# Altium schematic sheet catalog.SchDoc
size A4
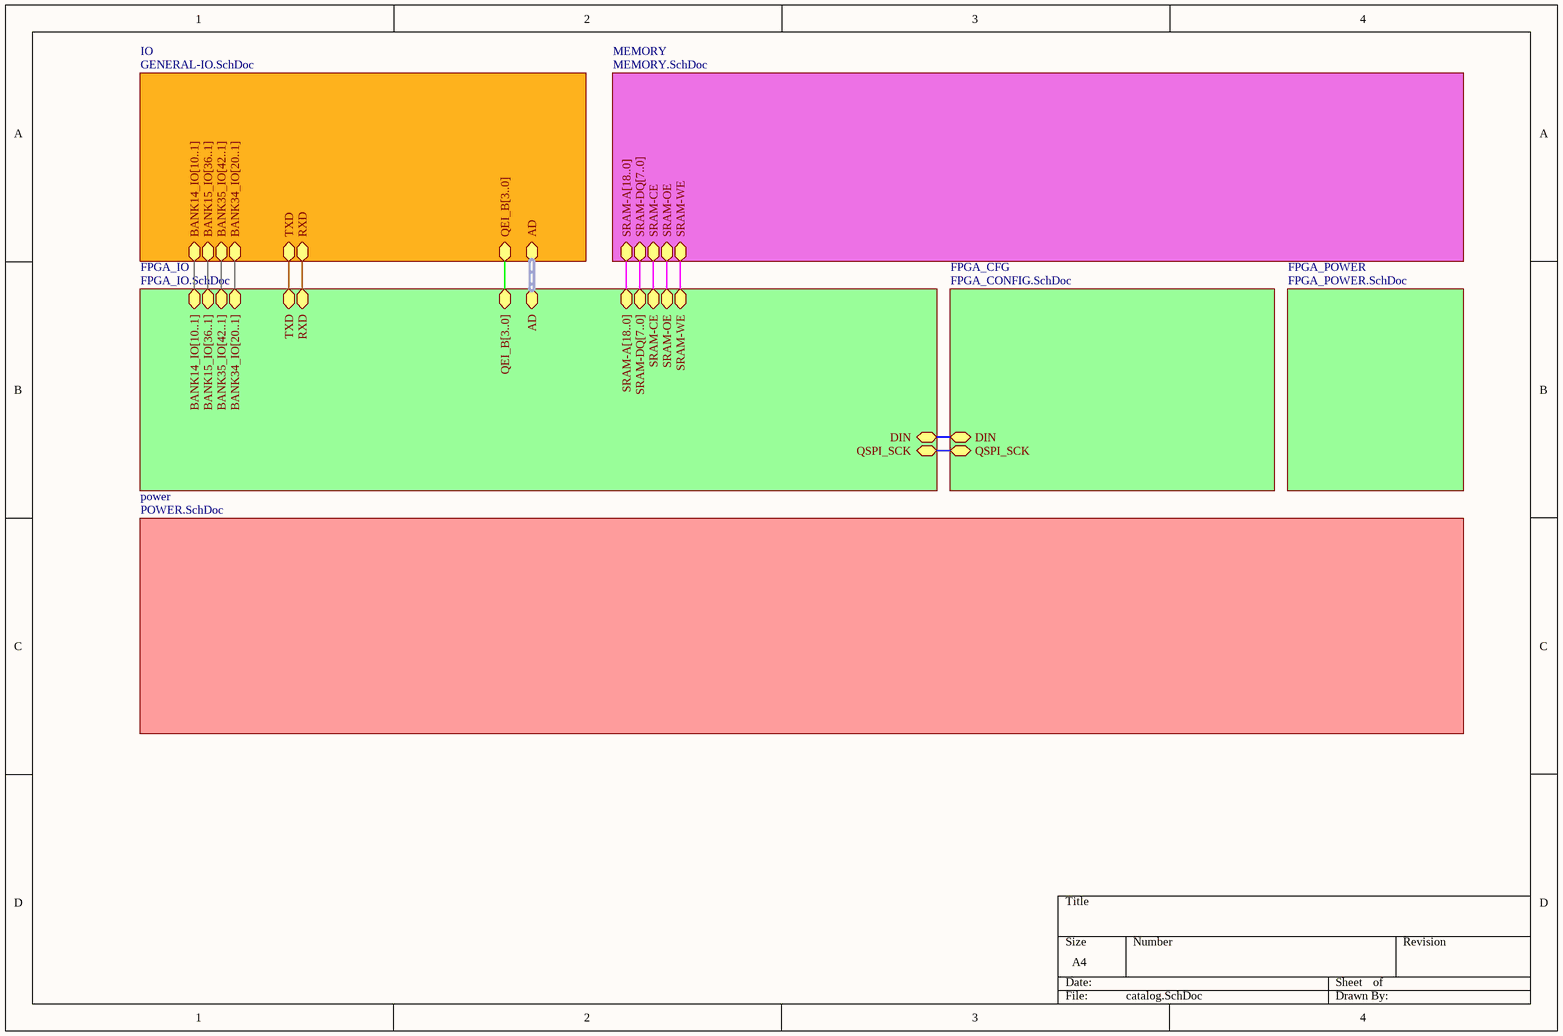
[diagram p0: catalog.SchDoc]

## Sub-sheets
FPGA_CFG = FPGA_CONFIG.SchDoc: QSPI_SCK, DIN
FPGA_IO = FPGA_IO.SchDoc: SRAM-A[18..0], SRAM-DQ[7..0], SRAM-CE, SRAM-OE, SRAM-WE, QSPI_SCK, AD (harness AIN), QEI_B[3..0], TXD, RXD, BANK14_IO[10..1], BANK15_IO[36..1], BANK34_IO[20..1], BANK35_IO[42..1], DIN
FPGA_POWER = FPGA_POWER.SchDoc: no entries
IO = GENERAL-IO.SchDoc: AD (harness AIN), QEI_B[3..0], BANK14_IO[10..1], BANK15_IO[36..1], BANK34_IO[20..1], BANK35_IO[42..1], TXD, RXD
MEMORY = MEMORY.SchDoc: SRAM-A[18..0], SRAM-DQ[7..0], SRAM-CE, SRAM-OE, SRAM-WE
power = POWER.SchDoc: no entries

## Nets
(unnamed): sheet FPGA_IO/SRAM-CE, sheet MEMORY/SRAM-CE
(unnamed): sheet FPGA_IO/SRAM-OE, sheet MEMORY/SRAM-OE
(unnamed): sheet FPGA_IO/SRAM-WE, sheet MEMORY/SRAM-WE
(unnamed): sheet FPGA_IO/QSPI_SCK, sheet FPGA_CFG/QSPI_SCK
(unnamed): sheet FPGA_IO/TXD, sheet IO/TXD
(unnamed): sheet FPGA_IO/RXD, sheet IO/RXD
(unnamed): sheet FPGA_IO/DIN, sheet FPGA_CFG/DIN

## Buses and harness runs
bus sheet FPGA_IO/BANK14_IO[10..1] = sheet IO/BANK14_IO[10..1]
bus sheet FPGA_IO/BANK15_IO[36..1] = sheet IO/BANK15_IO[36..1]
bus sheet FPGA_IO/BANK34_IO[20..1] = sheet IO/BANK34_IO[20..1]
bus sheet FPGA_IO/BANK35_IO[42..1] = sheet IO/BANK35_IO[42..1]
bus sheet FPGA_IO/QEI_B[3..0] = sheet IO/QEI_B[3..0]
bus sheet FPGA_IO/SRAM-A[18..0] = sheet MEMORY/SRAM-A[18..0]
bus sheet FPGA_IO/SRAM-DQ[7..0] = sheet MEMORY/SRAM-DQ[7..0]
harness sheet FPGA_IO/AD = sheet IO/AD